# EAGLE design pihat (EAGLE 7.7.0)
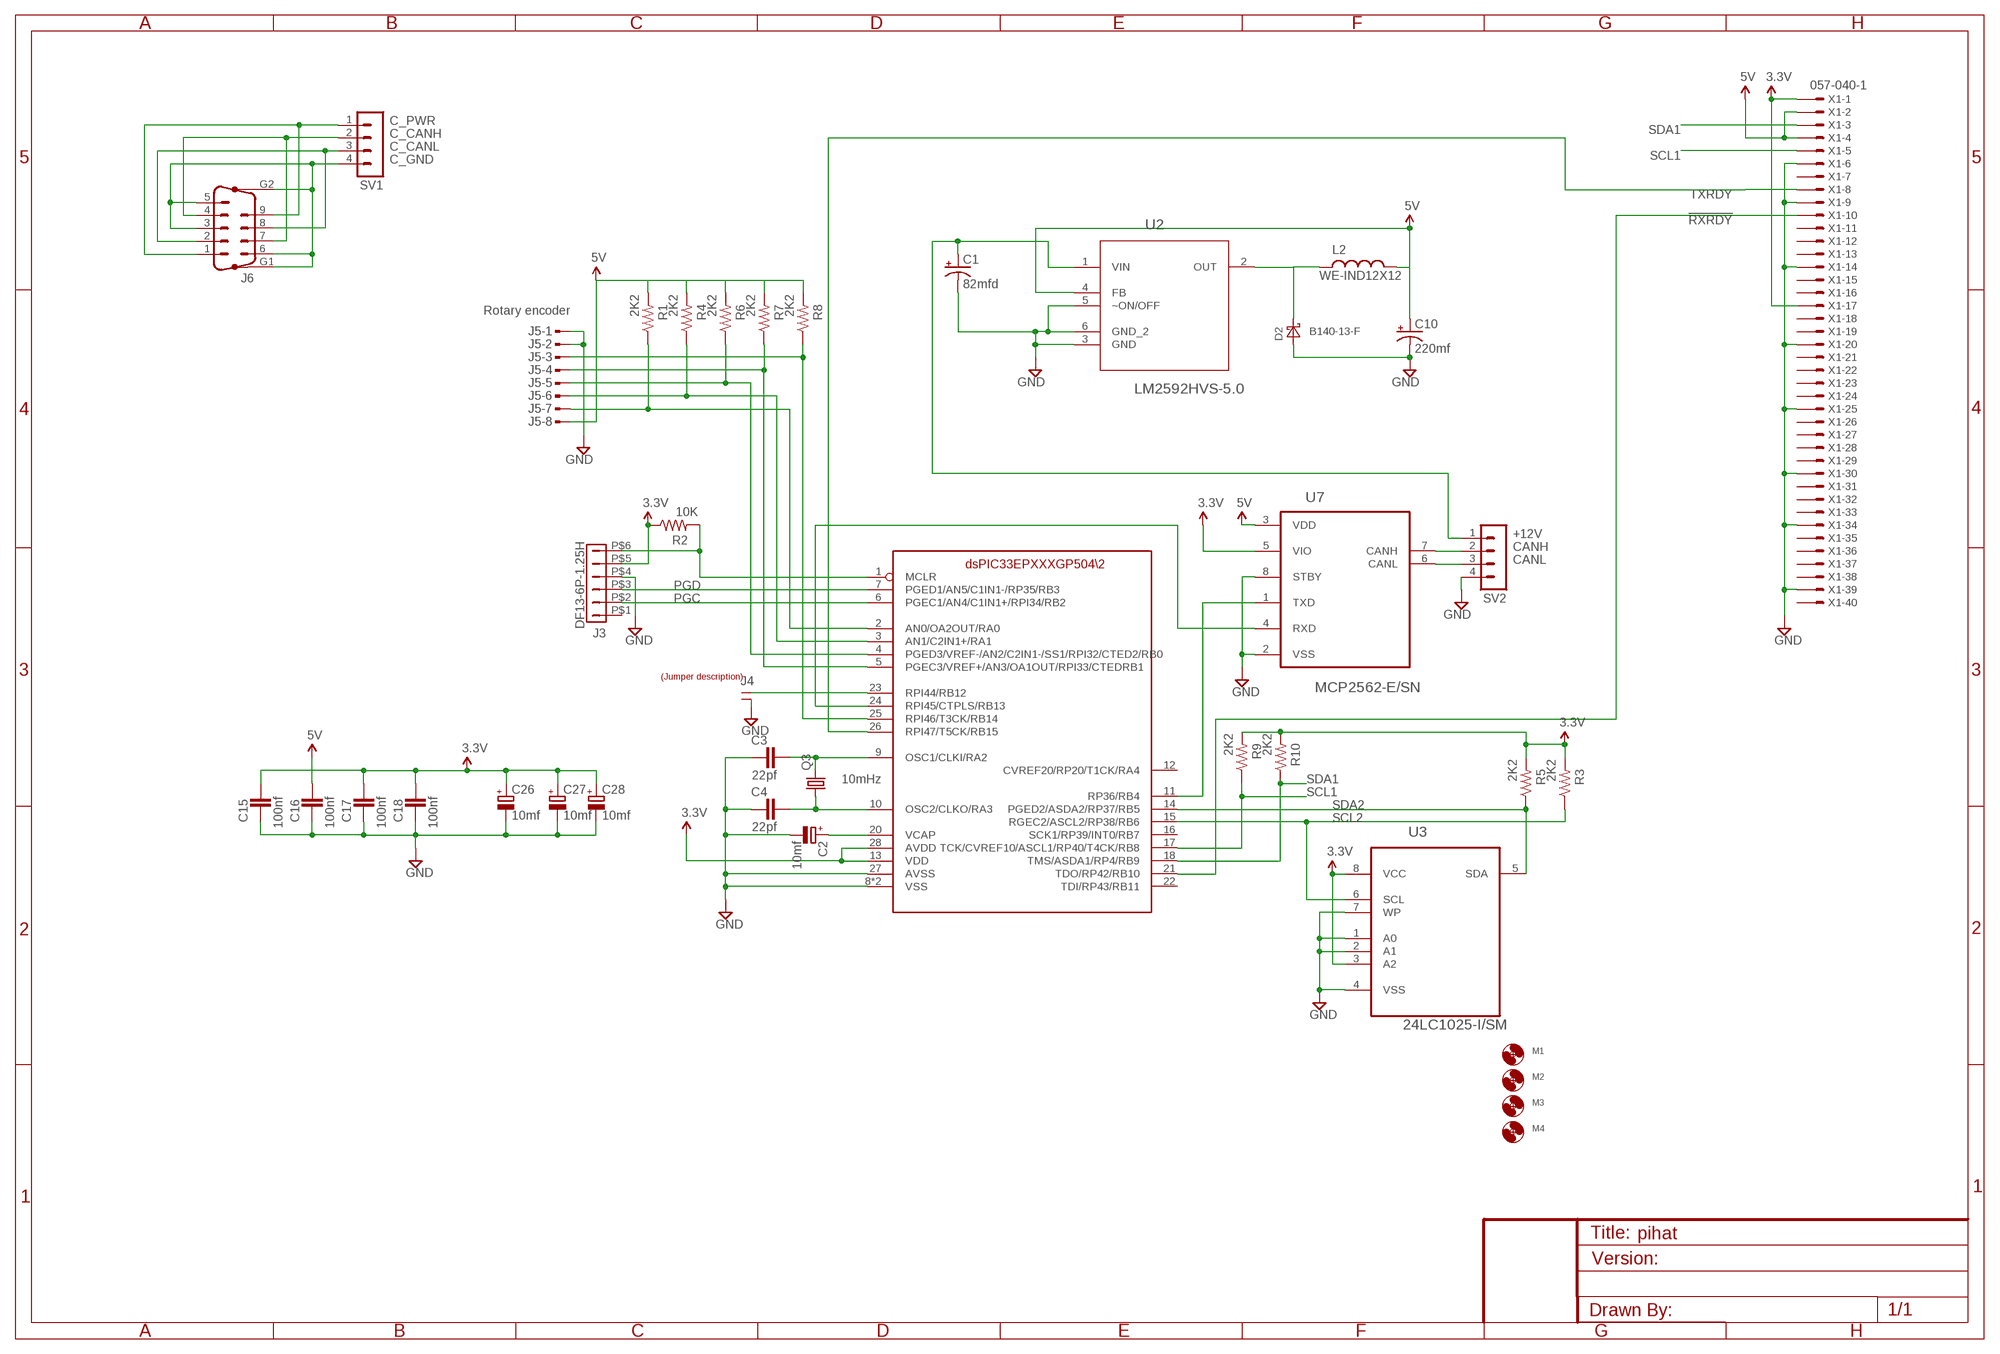
[diagram p0: schematic, sheet 1]

## Parts
C1  82mfd  CAPACITOR_POL-SVPF-E7  [SVPF-E7]
C2  10mf  CAPACITOR_POL-SMC_A  [SMC_A]
C3  22pf  CAPACITOR_NPOL-0805  [C805]
C4  22pf  CAPACITOR_NPOL-0805  [C805]
C10  220mf  CAP_POL7343  [EIA7343]
C15  100nf  CAPACITOR_NPOL-0805  [C805]
C16  100nf  CAPACITOR_NPOL-0805  [C805]
C17  100nf  CAPACITOR_NPOL-0805  [C805]
C18  100nf  CAPACITOR_NPOL-0805  [C805]
C26  10mf  CAPACITOR_POL-SMC_A  [SMC_A]
C27  10mf  CAPACITOR_POL-SMC_A  [SMC_A]
C28  10mf  CAPACITOR_POL-SMC_A  [SMC_A]
D2  B140-13-F  DIODE-SCHOTTKY-SMA  [SMA]
J3  DF13-6P-1.25H  [DF13A-6P-1.25H]
J4  JUMPER-1X2  [JUMPER-1X2]
J5  MTOP-8  [MTOP-8]
J6  M09VP  [M09VP]
L2  WE-IND12X12  [IND12X12]
M1  MOUNT-HOLE2.8  [2,8]
M2  MOUNT-HOLE2.8  [2,8]
M3  MOUNT-HOLE2.8  [2,8]
M4  MOUNT-HOLE2.8  [2,8]
Q3  10mHz  CRYSTALHC49S  [HC49/S]
R1  2K2  RESISTOR0603-RES  [0603-RES]
R2  10K  RESISTOR0603-RES  [0603-RES]
R3  2K2  RESISTOR0603-RES  [0603-RES]
R4  2K2  RESISTOR0603-RES  [0603-RES]
R5  2K2  RESISTOR0603-RES  [0603-RES]
R6  2K2  RESISTOR0603-RES  [0603-RES]
R7  2K2  RESISTOR0603-RES  [0603-RES]
R8  2K2  RESISTOR0603-RES  [0603-RES]
R9  2K2  RESISTOR0603-RES  [0603-RES]
R10  2K2  RESISTOR0603-RES  [0603-RES]
SV1  MA04-1  [MA04-1]
SV2  MA04-1  [MA04-1]
U2  LM2592HVS-5.0  [TO170P1435X457-5N]
U3  24LC1025-I/SM  [SOIC8-N_MC]
U4  DSPIC33EPXXXGP502  [SOIC-28]
U7  MCP2562-E/SN  [SOIC-8N]
U$1  LABEL_JUMPER_1X2  [JUMP2_DESC]
X1  057-040-1  [057-040-1]

## Nets
3.3V: C15.1 C17.1 C18.1 C26.+ C27.+ C28.+ J3.P$5 R2.1 R3.2 R5.2 R9.2 R10.2 U3.3(A2) U3.8(VCC) U4.13(VDD) U4.28(AVDD) U7.5(VIO) X1.1 X1.17
5V: C10.A(+) C16.1 J5.8 L2.P$2 R1.2 R4.2 R6.2 R7.2 R8.2 U2.4(FB) U7.3(VDD) X1.2 X1.4
!MCLR: J3.P$6 R2.2 U4.1(MCLR)
!RXRDY: U4.21(TDO/RP42/RB10) X1.10
+12V [12v]: C1.P$2(+) SV2.1 U2.1(VIN)
A+: J5.7 R1.1 U4.2(AN0/OA2OUT/RA0)
A-: J5.6 R4.1 U4.3(AN1/C2IN1+/RA1)
B+: J5.5 R6.1 U4.4(PGED3/VREF-/AN2/C2IN1-/SS1/RPI32/CTED2/RB0)
B-: J5.4 R7.1 U4.5(PGEC3/VREF+/AN3/OA1OUT/RPI33/CTEDRB1)
C_CANH: J6.4 J6.7 SV1.2
C_CANL: J6.2 J6.8 SV1.3
C_GND: J6.3 J6.5 J6.6 J6.G1 J6.G2 SV1.4
C_PWR: J6.1 J6.9 SV1.1
CANH: SV2.2 U7.7(CANH)
CANL: SV2.3 U7.6(CANL)
GND: C1.P$1(-) C2.- C3.2 C4.2 C10.C(-) C15.2 C16.2 C17.2 C18.2 C26.- C27.- C28.- D2.A J3.P$4 J4.2 J5.1 J5.2 SV2.4 U2.3(GND) U2.5(~ON/OFF) U2.6(GND_2) U3.1(A0) U3.2(A1) U3.4(VSS) U3.7(WP) U4.8(VSS) U4.19(VSS) U4.27(AVSS) U7.2(VSS) U7.8(STBY) X1.6 X1.9 X1.14 X1.20 X1.25 X1.30 X1.34 X1.39
N$12: D2.C L2.P$1 U2.2(OUT)
N$19: C3.1 Q3.2 U4.9(OSC1/CLKI/RA2)
N$24: U4.24(RPI45/CTPLS/RB13) U7.4(RXD)
N$25: C2.+ U4.20(VCAP)
N$26: U4.11(RP36/RB4) U7.1(TXD)
N$70: C4.1 Q3.1 U4.10(OSC2/CLKO/RA3)
PGC: J3.P$2 U4.6(PGEC1/AN4/C1IN1+/RPI34/RB2)
PGD: J3.P$3 U4.7(PGED1/AN5/C1IN1-/RP35/RB3)
RESET#: J4.1 U4.23(RPI44/RB12)
SCL1: R9.1 U4.17(TCK/CVREF10/ASCL1/RP40/T4CK/RB8) X1.5
SCL2: R3.1 U3.6(SCL) U4.15(RGEC2/ASCL2/RP38/RB6)
SDA1: R10.1 U4.18(TMS/ASDA1/RP4/RB9) X1.3
SDA2: R5.1 U3.5(SDA) U4.14(PGED2/ASDA2/RP37/RB5)
SW1: J5.3 R8.1 U4.25(RPI46/T3CK/RB14)
TXRDY: U4.26(RPI47/T5CK/RB15) X1.8
Unconnected: J3.P$1 U4.12(CVREF20/RP20/T1CK/RA4) U4.16(SCK1/RP39/INT0/RB7) U4.22(TDI/RP43/RB11) X1.7 X1.11 X1.12 X1.13 X1.15 X1.16 X1.18 X1.19 X1.21 X1.22 X1.23 X1.24 X1.26 X1.27 X1.28 X1.29 X1.31 X1.32 X1.33 X1.35 X1.36 X1.37 X1.38 X1.40

## Notes on the sheet
- Rotary encoder

## Library data of the parts
C1 = kotuku:CAPACITOR_POL: Polarized capacitor in various packages
C2 C26-C28 = dp_devices:CAPACITOR_POL: Polarized capacitor in various packages; PARTNO: T491A106K004AT
C3 C4 = dp_devices:CAPACITOR_NPOL: Non-Polarized capacitor in various packages; PARTNO: C0805C220J5GACTU
C10 = SparkFun:CAP_POL: Capacitor Polarized These are standard SMD and PTH capacitors. Normally 10uF, 47uF, and 100uF in electrolytic and tantalum varieties. Always verify the external diameter of the through hole cap, it varies with capacity, voltage, and manufacturer. The EIA devices should be standard.; PARTNO: T545X227M016ATE035
C15-C18 = dp_devices:CAPACITOR_NPOL: Non-Polarized capacitor in various packages; PARTNO: CL21F104ZBCNNNC
D2 = diode2:DIODE-SCHOTTKY-: SCHOTTKY DIODE; PARTNO: B140-13-F
J3 = con-hirose-df13:DF13-6P-1.25: DF13-6P 1.25mm Pitch Miniature Crimping Connector.; PARTNO: DF13A-6P-1.25H(20)
J4 = QuantumOptics:JUMPER-1X2: Jumper, header, SIP on 0.1" grid, for option selection.; PARTNO: M20-9770246
J5 = con-amp:MTOP-8: AMP connector; PARTNO: 7-215079-8
J6 = con-subd:M09VP: SUB-D; OC_FARNELL: unknown; OC_NEWARK: unknown
L2 = kotuku:WE-IND12X12
M1-M4 = tdk:MOUNT-HOLE: MOUNTING HOLE with drill center marker
Q3 = crystal:CRYSTAL: CRYSTAL; OC_FARNELL: 1667008; OC_NEWARK: unknown; PARTNO: ATS100B-E
R1 R3-R10 = SparkFun-Passives:RESISTOR: Resistor Basic schematic elements and footprints for 0603, 1206, and PTH resistors.; PARTNO: RC0603FR-072K2L
R2 = SparkFun-Passives:RESISTOR: Resistor Basic schematic elements and footprints for 0603, 1206, and PTH resistors.; PARTNO: RC0603FR-0710KL
SV1 SV2 = con-lstb:MA04-1: PIN HEADER; OC_FARNELL: unknown; OC_NEWARK: unknown
U2 = NSC_By_element14_Batch_1.1:LM2592HVS-5.0: SIMPLE SWITCHER; MPN: LM2592HVS-5.0; OC_FARNELL: -; OC_NEWARK: 41K3791; PACKAGE: TO-263-5; PARTNO: LM2592HVSX-5.0/NOPB; SUPPLIER: National Semiconductor
U3 = Microchip_By_element14_Batch_1:24LC1025-I/SM: 1024K I2C CMOS Serial EEPROM; PARTNO: 24LC1025T-I/SN
U4 = kotuku:DSPIC33EPXXXGP502
U7 = Microchip-MCP2562-E_SN:MCP2562-E/SN: High-Speed CAN Transceiver,SOIC-8; PARTNO: MCP2562-E/SN
U$1 = dp_devices:LABEL_JUMPER_1X2: Nice formatted two legged jumperdescription Use attributes to change the values ON = With jumper OFF = Without jumper; OFF: Normal; ON: Reset
X1 = con-panduit-changed:057-040-: CONNECTOR 40-pin series 057 contact pc board low profile headers; OC_FARNELL: unknown; OC_NEWARK: unknown

## Net classes
2 12v: width 0.152 mm, drill 0.305 mm, clearance 0.305 mm

## Board
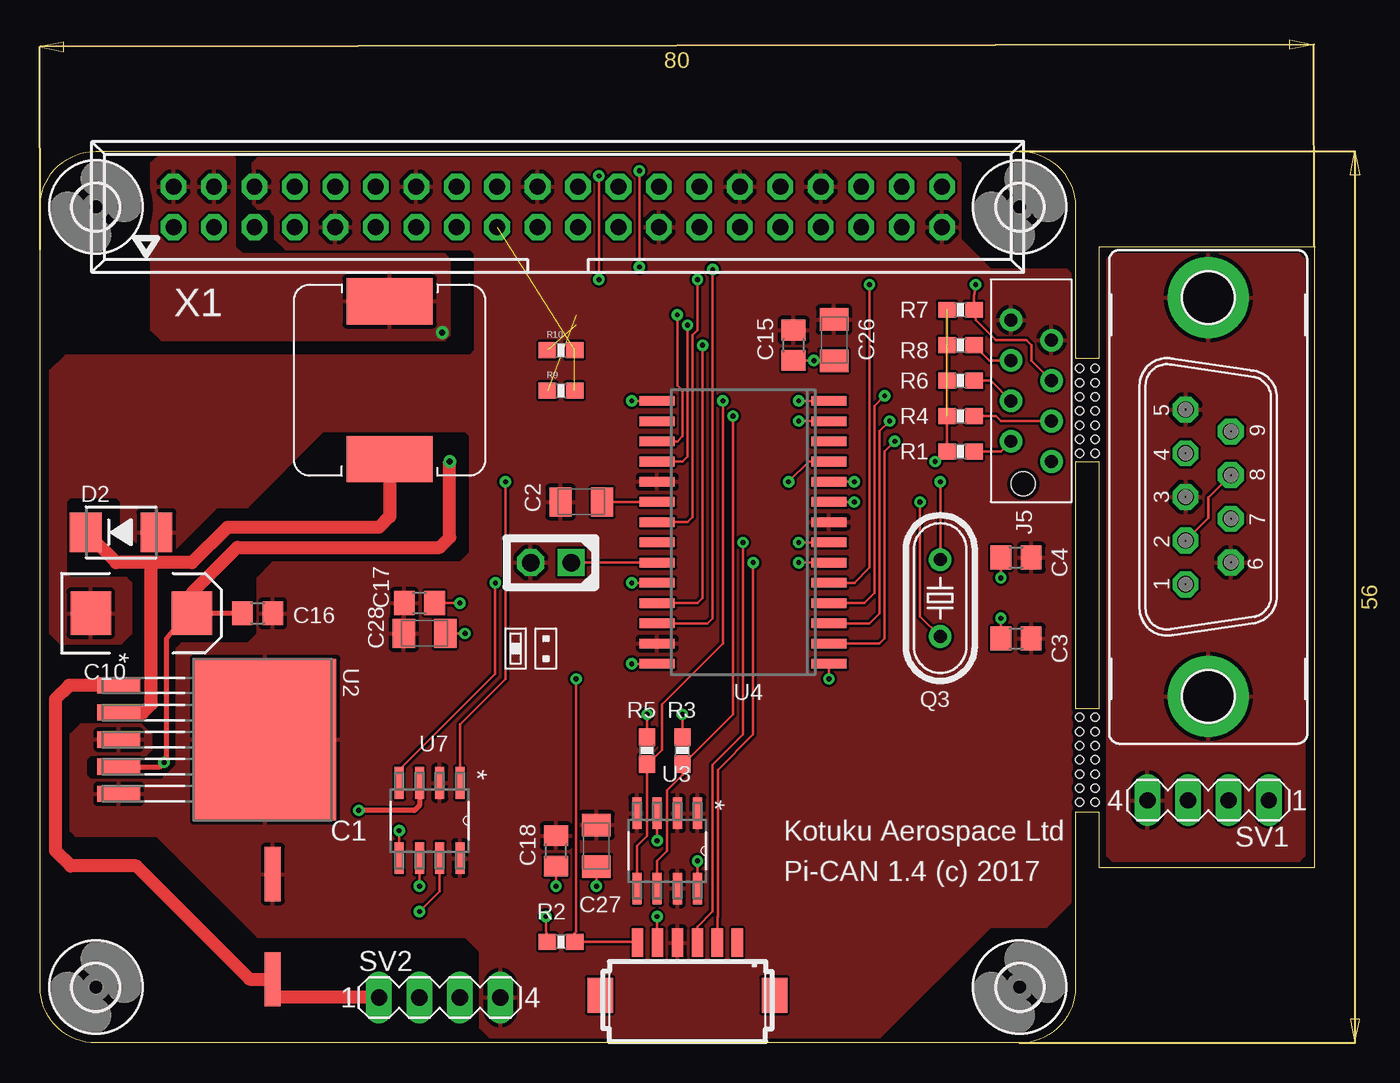
[diagram p1: board, top side]
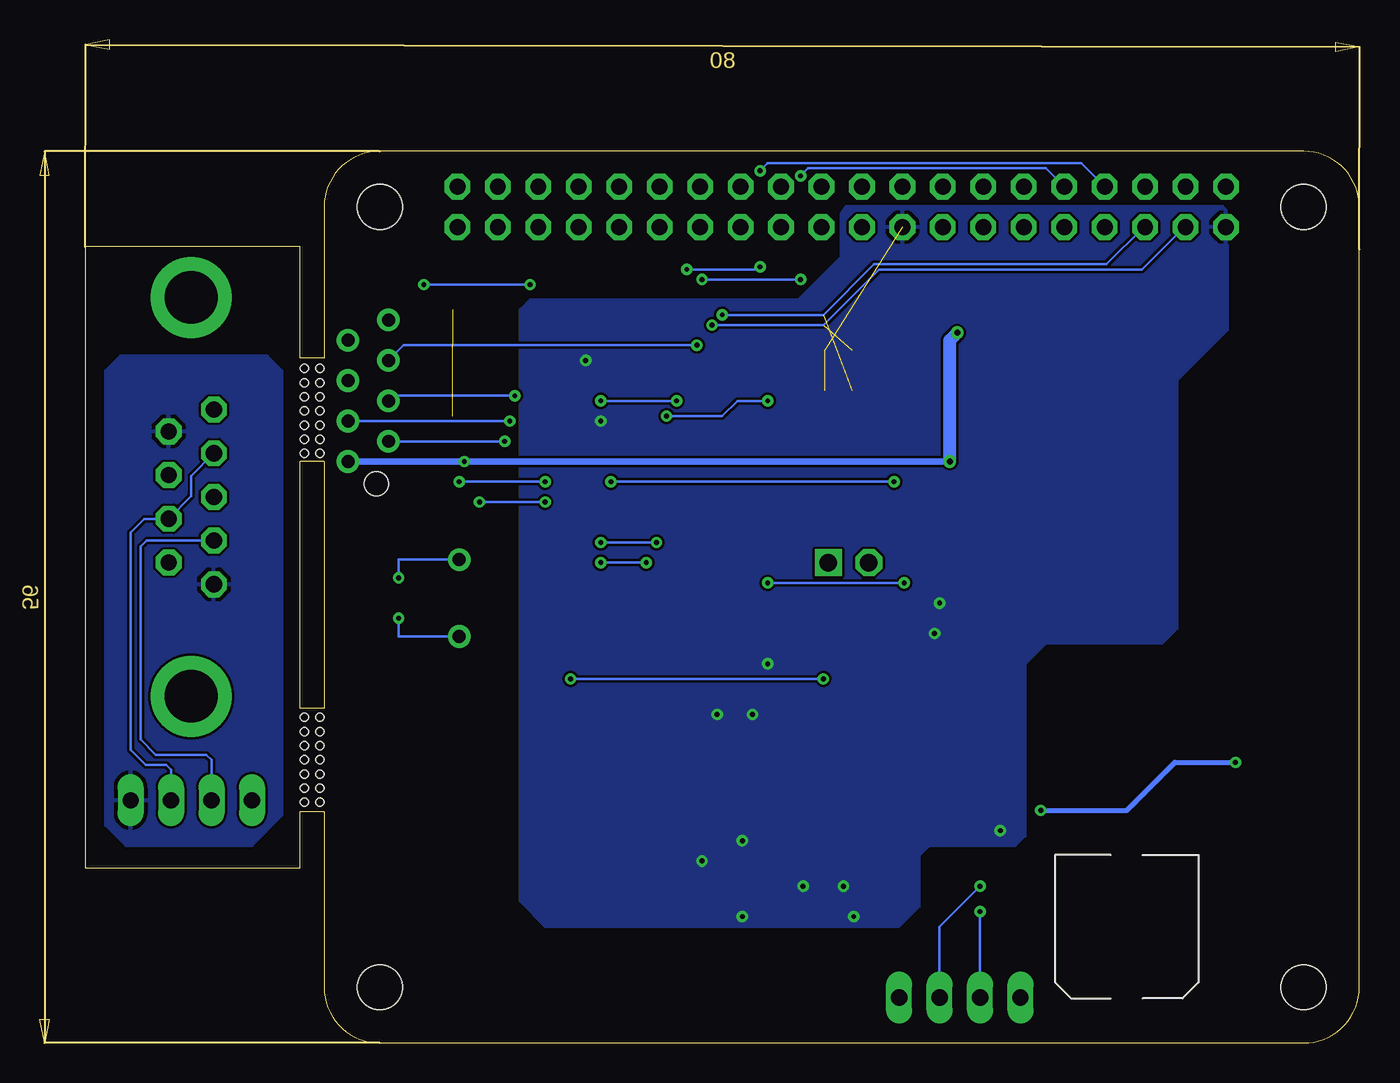
[diagram p2: board, bottom side, seen from below]

Size 80 x 56 mm. Coordinates in mm from the lower left corner, seen from the top.
Outline: 0,3.5 0,52.5 arc-90 3.5,56 61.5,56 arc-90 65,52.5 65,43 66.5,43 66.5,50 80,50 80,11 66.5,11 66.5,14.5 65,14.5 65,3.5 arc-90 61.5,0 3.5,0 arc-90 0,3.5
Outline: 65,36.5 65,21 66.5,21 66.5,36.5 65,36.5
Copper layers (1*16): Top 0.035mm / dielectric 1.5mm / Bottom 0.035mm
Design rules "DFRobot_Eagle_Rule_v0.4": minimum track width 6mil, minimum drill 12mil, track to track 6mil, track to pad 6mil, pad to pad 6mil, via to via 6mil, smd to smd 0mil, copper to edge 10mil, drill to drill 10mil, minimum pad ring 12mil, minimum via ring 8mil, stop-mask expansion 2mil, vias tented up to drill 25mil, thermal gap 10mil
Holes 0.5 mm at 65.28,42.35 65.28,41.47 65.28,40.58 65.28,39.69 65.28,38.8 65.28,37.91 65.28,37.02 65.28,20.45 65.28,19.56 65.28,18.67 65.28,17.78 65.28,16.89 65.28,16 65.28,15.11 66.23,42.35 66.23,41.47 66.23,40.58 66.23,39.69 66.23,38.8 66.23,37.91 66.23,37.02 66.23,20.45 66.23,19.56 66.23,18.67 66.23,17.78 66.23,16.89 66.23,16 66.23,15.11

### Footprints (pad centres in the part's own frame; a part is rotated, then mirrored left to right if it is on the bottom)
SVPF-E7 = smd 1 x 3.4: P$1 0,3.3; P$2 0,-3.3
SMC_A = smd 1.4 x 1.8: + -1.3,0; - 1.3,0
C805 = smd 1.3 x 1.5: 1 -0.95,0; 2 0.95,0
EIA7343 = smd 2.55 x 2.7: A 3.17,0; C -3.17,0
SMA = smd 2 x 2.5: A 2.223,0; C -2.223,0
DF13A-6P-1.25H = smd 1.6 x 2.2: M$0 -5.475,2.4; M$1 5.475,2.4 | smd 0.7 x 1.8: P$1 -3.125,-0.9; P$2 -1.875,-0.9; P$3 -0.625,-0.9; P$4 0.625,-0.9; P$5 1.875,-0.9; P$6 3.125,-0.9
JUMPER-1X2 = drill 1.092 square: 1 0,2.54 | drill 1.092 octagon: 2 0,0
MTOP-8 = drill 0.813: 1 4.445,1.27; 2 3.175,-1.27; 3 1.905,1.27; 4 0.635,-1.27; 5 -0.635,1.27; 6 -1.905,-1.27; 7 -3.175,1.27; 8 -4.445,-1.27 | hole 1.5: -5.842,0.508
M09VP = drill 1.016 octagon: 1 -5.486,1.422; 2 -2.743,1.422; 3 0,1.422; 4 2.743,1.422; 5 5.486,1.422; 6 -4.115,-1.422; 7 -1.372,-1.422; 8 1.372,-1.422; 9 4.115,-1.422 | drill 3.302 pad 5.08: G1 -12.522,0; G2 12.522,0
IND12X12 = smd 5.4 x 2.9: P$1 6,10.95; P$2 6,1.05
2,8 = hole 2.8: 0,0
HC49/S = drill 0.813: 1 -2.413,0; 2 2.413,0
0603-RES = smd 1.1 x 1: 1 -0.85,0; 2 0.85,0
MA04-1 = drill 1.016 long: 1 -3.81,0; 2 -1.27,0; 3 1.27,0; 4 3.81,0
TO170P1435X457-5N = smd 1.016 x 2.692: 1 -3.404,-9.042; 2 -1.702,-9.042; 3 0,-9.042; 4 1.702,-9.042; 5 3.404,-9.042 | smd 10.16 x 8.941: 6 0,0.152
SOIC8-N_MC = smd 1.981 x 0.559: 1 -2.362,1.905; 2 -2.362,0.635; 3 -2.362,-0.635; 4 -2.362,-1.905; 5 2.362,-1.905; 6 2.362,-0.635; 7 2.362,0.635; 8 2.362,1.905
SOIC-28 = smd 0.6 x 2.2: 1 -8.255,-5.4; 2 -6.985,-5.4; 3 -5.715,-5.4; 4 -4.445,-5.4; 5 -3.175,-5.4; 6 -1.905,-5.4; 7 -0.635,-5.4; 8 0.635,-5.4; 9 1.905,-5.4; 10 3.175,-5.4; 11 4.445,-5.4; 12 5.715,-5.4; 13 6.985,-5.4; 14 8.255,-5.4; 15 8.255,5.4; 16 6.985,5.4; 17 5.715,5.4; 18 4.445,5.4; 19 3.175,5.4; 20 1.905,5.4; 21 0.635,5.4; 22 -0.635,5.4; 23 -1.905,5.4; 24 -3.175,5.4; 25 -4.445,5.4; 26 -5.715,5.4; 27 -6.985,5.4; 28 -8.255,5.4
SOIC-8N = smd 1.981 x 0.559: 1 1.448,5.715; 2 1.448,4.445; 3 1.448,3.175; 4 1.448,1.905; 5 6.172,1.905; 6 6.172,3.175; 7 6.172,4.445; 8 6.172,5.715
057-040-1 = drill 1 octagon: 1 -24.13,-1.27; 2 -24.13,1.27; 3 -21.59,-1.27; 4 -21.59,1.27; 5 -19.05,-1.27; 6 -19.05,1.27; 7 -16.51,-1.27; 8 -16.51,1.27; 9 -13.97,-1.27; 10 -13.97,1.27; 11 -11.43,-1.27; 12 -11.43,1.27; 13 -8.89,-1.27; 14 -8.89,1.27; 15 -6.35,-1.27; 16 -6.35,1.27; 17 -3.81,-1.27; 18 -3.81,1.27; 19 -1.27,-1.27; 20 -1.27,1.27; 21 1.27,-1.27; 22 1.27,1.27; 23 3.81,-1.27; 24 3.81,1.27; 25 6.35,-1.27; 26 6.35,1.27; 27 8.89,-1.27; 28 8.89,1.27; 29 11.43,-1.27; 30 11.43,1.27; 31 13.97,-1.27; 32 13.97,1.27; 33 16.51,-1.27; 34 16.51,1.27; 35 19.05,-1.27; 36 19.05,1.27; 37 21.59,-1.27; 38 21.59,1.27; 39 24.13,-1.27; 40 24.13,1.27

### Placement (x,y rotation side)
C1  14.61,7.3 0 top
C2  33.97,33.97 180 top
C3  61.28,25.4 0 top
C4  61.28,30.48 0 top
C10  6.35,26.99 0 top
C15  47.31,43.81 90 top
C16  13.65,26.99 0 top
C17  23.81,27.62 180 top
C18  32.38,12.06 90 top
C26  49.85,44.13 90 top
C27  34.92,12.38 90 top
C28  24.13,25.72 180 top
D2  5.08,32.07 0 top
J3  40.64,5.4 180 top
J4  30.8,30.16 270 top
J5  62.23,40.96 90 top
J6  73.34,34.29 90 top
L2  27.94,47.62 180 top
M1  3.5,3.5 0 top
M2  3.5,52.5 0 top
M3  61.5,3.5 0 top
M4  61.5,52.5 0 top
Q3  56.52,27.94 270 top
R1  57.78,37.15 180 top
R2  32.7,6.35 0 top
R3  40.32,18.37 90 top
R4  57.78,39.37 180 top
R5  38.1,18.37 90 top
R6  57.78,41.59 180 top
R7  57.78,46.04 180 top
R8  57.78,43.81 180 top
R9  32.7,40.96 0 top
R10  32.7,43.5 0 top
SV1  73.34,15.24 180 top
SV2  25.08,2.86 0 top
U2  13.97,19.05 270 top
U3  39.37,12.06 270 top
U4  44.13,32.07 90 top
U7  20.64,17.78 270 top
U$1  30.48,22.23 270 top
X1  32.5,52.5 0 top

### Tracks (layer width: path | path; a pad name or v marks a point on that pad's centre or on a via)
3.3V  (via drill 0.3)  (3 unrouted)
  Top 0.152: C17.1 v26.35,27.62 | C28.+ 26.04,25.69 26.04,25.72 v26.67,25.72 | U7.5 v22.54,13.34 | U3.3 v38.73,12.7 | U3.8 v41.27,11.43 | C27.+ v34.92,9.84 | C18.1 v32.38,9.84 | R3.2 v40.32,20.64 | R5.2 v38.1,20.64 | R2.1 31.75,7.09 v31.75,7.94 | C15.1 v48.58,42.87 v48.58,42.86 48.61,42.83 C26.+ | U4.13 v47.62,39.05 | U4.28 v37.15,23.81 | J3.P$5 38.73,6.33 v38.73,7.94
  pour Bottom (rank 2): 8.26,44.77 8.26,52.23 8.57,52.55 32.23,52.55 32.54,52.07 32.54,49.37 35.24,46.67 52.07,46.67 52.7,46.04 52.7,8.89 51.12,7.3 28.89,7.3 27.62,8.57 27.62,11.75 26.99,12.38 21.59,12.38 20.95,13.02 20.95,23.81 19.68,25.08 12.38,25.08 11.43,26.04 11.43,41.59
5V  (via drill 0.3, 0.38)  (3 unrouted)
  Top 0.152: R7.2 R1.2 56.83,37.15 v56.2,36.51
  Top 0.305: U2.4 7.51,17.35 v7.78,17.62 7.94,17.78 7.94,25.4 9.21,26.99 | 9.21,26.99 9.21,26.68 | C16.1 9.21,26.99 | U7.3 23.81,14.92 23.5,14.61 v20,14.61
  Top 0.813: 9.21,26.68 C10.A 9.52,28.25 12.38,31.11 25.08,31.11 25.72,31.75 v25.72,36.51
  Bottom 0.305: v20,14.61 14.61,14.61 11.59,17.62 v7.78,17.62
  Bottom 0.406: J5.8 v56.2,36.51 v25.72,36.51
  Bottom 0.813: v25.72,36.51 25.72,44.13 v25.24,44.61
  pour Top: 6.99,55.24 7.62,55.88 11.91,55.88 12.22,55.56 12.22,50.01 12.7,49.53 25.4,49.53 25.72,49.21 25.72,44.45 25.4,44.13 7.62,44.13 6.99,44.77
!MCLR  (via drill 0.3)
  Top 0.152: v33.66,22.86 33.66,6.99 33.55,6.88 R2.2 37.46,6.35 J3.P$6 | v49.53,22.86 U4.1
  Bottom 0.152: v33.66,22.86 v49.53,22.86
!RXRDY  (via drill 0.3)
  Top 0.152: v35.08,54.45 v35.08,47.94 | v41.27,47.94 41.27,44.77 40.96,44.45 40.96,33.02 40.64,32.7 U4.21
  Bottom 0.152: X1.10 19.69,54.93 34.61,54.93 v35.08,54.45 | v35.08,47.94 v41.27,47.94
+12V
  Top 0.61: C1.P$2
  Top 0.813: U2.1 1.82,22.45 0.95,21.59 0.95,12.06 1.91,11.11 6.03,11.11 13.14,4 C1.P$2 14.61,2.86 SV2.1
A+  (via drill 0.3)
  Top 0.152: J5.7 60.33,37.15 R1.1 | U4.2 52.7,25.08 53.02,25.4 53.02,37.15 v53.66,37.78
  Bottom 0.152: v53.66,37.78 J5.7
A-  (via drill 0.3)
  Top 0.152: J5.6 60.33,39.05 60.01,39.37 R4.1 | U4.3 52.07,26.35 52.7,26.99 52.7,38.42 v53.34,39.05
  Bottom 0.152: v53.34,39.05 J5.6
B+  (via drill 0.3)
  Top 0.152: J5.5 59.69,41.59 R6.1 | U4.4 51.75,27.62 52.39,28.26 52.39,40.01 v53.02,40.64
  Bottom 0.152: v53.02,40.64 60.64,40.64 J5.5
B-  (via drill 0.3)
  Top 0.152: J5.4 62.23,42.86 62.23,43.81 61.91,44.13 60.01,44.13 58.74,45.4 R7.1 58.63,46.89 v58.74,47.62 | U4.5 51.12,28.89 52.07,29.84 v52.07,47.62
  Bottom 0.152: v52.07,47.62 v58.74,47.62
C_CANH
  Bottom 0.152: J6.4 73.34,35.61 73.34,34.34 J6.7 76.3,32.92 77.15,32.07 77.15,18.41 76.2,17.46 74.93,17.46 74.61,17.14 SV1.2
C_CANL
  Top 0.152: J6.8 73.34,34.24 73.34,32.97 J6.2
  Bottom 0.152: J6.2 76.14,31.55 76.52,31.17 76.52,19.05 75.56,18.1 72.39,18.1 72.07,17.78 SV1.3
C_GND
  pour Top: 66.99,49.21 67.31,49.53 67.63,49.53 79.06,49.53 79.38,49.21 79.38,48.9 79.38,11.75 79.06,11.43 67.31,11.43 66.99,11.75
C_PWR
  pour Bottom: 67.63,42.23 68.58,43.18 77.79,43.18 78.74,42.23 78.74,13.65 77.47,12.38 69.53,12.38 67.63,14.29
CANH  (via drill 0.3)
  Top 0.152: 25.07,11.6 U7.7 25.08,9.53 v23.81,8.26
  Bottom 0.152: v23.81,8.26 SV2.2
CANL  (via drill 0.3)
  Top 0.152: U7.6 23.82,11.6 23.81,11.59 v23.81,9.84
  Bottom 0.152: v23.81,9.84 26.35,7.3 SV2.3
GND
  pour Top (rank 2): 0.64,42.23 1.59,43.18 26.99,43.18 27.3,43.5 27.3,49.53 26.99,49.85 15.4,49.85 14.76,50.48 14.76,51.91 14.61,52.07 14.45,52.39 13.65,52.39 13.34,52.7 13.34,55.24 13.65,55.56 57.47,55.56 57.78,55.24 57.78,50.48 59.69,48.58 64.45,48.58 64.77,48.26 64.77,8.89 63.18,7.3 59.69,7.3 52.7,0.32 28.26,0.32 27.62,0.95 27.62,5.71 26.67,6.67 13.65,6.67 7.3,13.02 2.22,13.02 1.91,13.34 1.91,19.37 2.54,20 6.35,20 6.99,19.37 6.99,18.41 6.67,18.1 3.17,18.1 2.86,17.78 2.86,16.83 3.17,16.51 7.62,16.51 8.57,17.46 8.57,24.77 8.89,25.08 13.02,25.08 13.65,25.72 13.65,29.21 14.61,30.16 26.35,30.16 26.99,30.8 26.99,38.1 26.67,38.42 17.78,38.42 13.02,33.66 11.11,33.66 8.57,31.11 6.35,31.11 5.08,32.38 5.08,33.97 4.76,34.29 1.91,34.29 1.59,33.97 1.59,29.53 1.91,29.21 5.4,29.21 5.71,28.89 5.71,25.72 5.08,25.08 1.27,25.08 0.64,25.72
N$12
  Top 0.813: U2.2 6.46,20.75 6.99,21.27 6.99,30.16 | 6.99,30.16 4.76,30.16 D2.C | 22.1,36.51 L2.P$1 21.94,33.05 21.27,32.38 11.75,32.38 9.53,30.16 6.99,30.16
N$19  (via drill 0.3)
  Top 0.152: v60.33,26.67 C3.1 | U4.9 v51.12,33.97 | v55.24,33.97 55.24,26.8 Q3.2
  Bottom 0.152: Q3.2 60.33,25.53 v60.33,26.67 | v51.12,33.97 v55.24,33.97
N$24  (via drill 0.3)
  Top 0.152: U7.4 22.54,17.14 28.57,23.18 v28.57,28.89 | v37.15,28.89 U4.24
  Bottom 0.152: v28.57,28.89 v37.15,28.89
N$25
  Top 0.152: C2.+ U4.20
N$26  (via drill 0.3)
  Top 0.152: U7.1 26.35,20 29.21,22.86 v29.21,35.24 | v46.99,35.24 48.26,36.51 U4.11
  Bottom 0.152: v29.21,35.24 v46.99,35.24
N$70  (via drill 0.3)
  Top 0.152: v60.33,29.21 C4.1 | U4.10 v51.12,35.24 | v56.52,35.24 Q3.1
  Bottom 0.152: Q3.1 60.33,30.35 v60.33,29.21 | v51.12,35.24 v56.52,35.24
PGC  (via drill 0.3)
  Top 0.152: U4.6 v47.62,30.16 | v44.77,30.16 44.77,19.37 42.55,17.14 42.55,7.94 42.52,7.91 J3.P$2
  Bottom 0.152: v47.62,30.16 v44.77,30.16
PGD  (via drill 0.3)
  Top 0.152: U4.7 v47.62,31.43 | v44.13,31.43 44.13,19.37 42.23,17.46 42.23,8.26 41.27,7.29 J3.P$3
  Bottom 0.152: v47.62,31.43 v44.13,31.43
RESET#
  Top 0.152: J4.1 U4.23
SCL1  (via drill 0.3)  (1 unrouted)
  Top 0.152: v40.01,45.72 40.01,41.27 40.32,40.96 40.32,38.1 40.01,37.78 U4.17
  Bottom 0.152: X1.5 13.54,51.23 15.88,48.9 30.48,48.9 33.66,45.72 v40.01,45.72
SCL2  (via drill 0.3)
  Top 0.152: U3.6 38.73,11.43 39.37,12.06 39.37,15.88 40.32,16.83 R3.1 40.38,17.52 43.5,20.64 v43.5,39.37 | U4.15 v37.15,40.32
  Bottom 0.152: v37.15,40.32 39.05,40.32 40.01,39.37 v43.5,39.37
SDA1  (via drill 0.3)  (1 unrouted)
  Top 0.152: v40.64,45.09 40.64,36.83 40.32,36.51 U4.18
  Bottom 0.152: X1.3 11,51.23 13.65,48.58 30.16,48.58 33.66,45.09 v40.64,45.09
SDA2  (via drill 0.3)
  Top 0.152: U3.5 37.47,12.38 38.1,13.02 R5.1 38.16,17.52 39.05,18.41 39.05,21.27 42.86,25.08 v42.86,40.32 | U4.14 v47.62,40.32
  Bottom 0.152: v47.62,40.32 v42.86,40.32
SW1  (via drill 0.3)
  Top 0.152: J5.3 59.59,42.86 R8.1 | U4.25 41.27,27.62 41.59,27.94 v41.59,43.81
  Bottom 0.152: v41.59,43.81 60.01,43.81 J5.3
TXRDY  (via drill 0.3)
  Top 0.152: v37.62,54.77 v37.62,48.74 | v42.23,48.58 42.23,26.67 41.91,26.35 U4.26
  Bottom 0.152: X1.8 17.46,55.24 37.15,55.24 v37.62,54.77 | v37.62,48.74 37.78,48.58 v42.23,48.58

### Text on the board
tPlace: Kotuku Aerospace Ltd | Pi-CAN 1.4 (c) 2017